# Altium schematic sheet IO.SchDoc
size A3; SheetNumber: 3; SheetTotal: 4
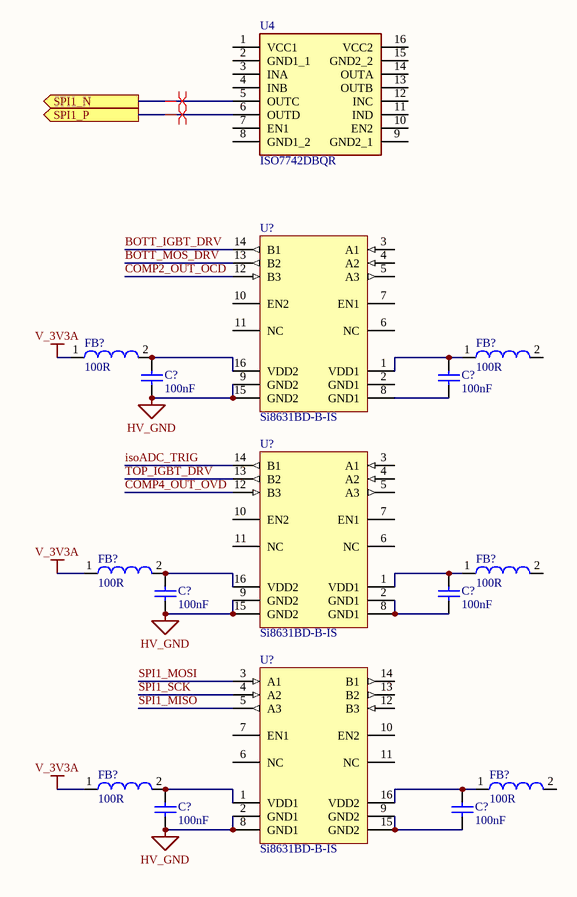
[diagram p0: IO.SchDoc]

## Parts
(Parts that share a designator on the sheet are numbered #1, #2 ... from top to bottom, then left to right.)
C?#1  100nF  [CAPC1608X90X35NL15T15]
C?#2  100nF  [CAPC1608X90X35NL15T15]
C?#3  100nF  [CAPC1608X90X35NL15T15]
C?#4  100nF  [CAPC1608X90X35NL15T15]
C?#5  100nF  [CAPC1608X90X35NL15T15]
C?#6  100nF  [CAPC1608X90X35NL15T15]
FB?#1  100R  [SMD-0603]
FB?#2  100R  [SMD-0603]
FB?#3  100R  [SMD-0603]
FB?#4  100R  [SMD-0603]
FB?#5  100R  [SMD-0603]
FB?#6  100R  [SMD-0603]
U4  ISO7742DBQR  [SOP64P600X175-16N]
U?#1  Si8631BD-B-IS  [SLAB-SOIC-16-WB_N]
U?#2  Si8631BD-B-IS  [SLAB-SOIC-16-WB_N]
U?#3  Si8631BD-B-IS  [SLAB-SOIC-16-WB_N]

## Ports
SPI1_N (out), SPI1_P (out)

## Nets
HV_GND: C?#1.1 C?#3.1 C?#5.1 U?#1.9(GND2) U?#1.15(GND2) U?#2.9(GND2) U?#2.15(GND2) U?#3.2(GND1) U?#3.8(GND1)
V_3V3A: FB?#1.1 FB?#3.1 FB?#5.1
BOTT_IGBT_DRV: U?#1.14(B1)
BOTT_MOS_DRV: U?#1.13(B2)
COMP2_OUT_OCD: U?#1.12(B3)
COMP4_OUT_OVD: U?#2.12(B3)
isoADC_TRIG: U?#2.14(B1)
SPI1_MISO: U?#3.5(A3)
SPI1_MOSI: U?#3.3(A1)
SPI1_N: U4.5(OUTC) ; port SPI1_N
SPI1_P: U4.6(OUTD) ; port SPI1_P
SPI1_SCK: U?#3.4(A2)
TOP_IGBT_DRV: U?#2.13(B2)
NetC?#1_2: C?#1.2 FB?#1.2 U?#1.16(VDD2)
NetC?#2_1: C?#2.1 U?#1.8(GND1)
NetC?#2_2: C?#2.2 FB?#2.1 U?#1.1(VDD1)
NetC?#3_2: C?#3.2 FB?#3.2 U?#2.16(VDD2)
NetC?#4_1: C?#4.1 U?#2.2(GND1) U?#2.8(GND1)
NetC?#4_2: C?#4.2 FB?#4.1 U?#2.1(VDD1)
NetC?#5_2: C?#5.2 FB?#5.2 U?#3.1(VDD1)
NetC?#6_1: C?#6.1 U?#3.9(GND2) U?#3.15(GND2)
NetC?#6_2: C?#6.2 FB?#6.1 U?#3.16(VDD2)

Not connected (* = marked no-connect by the designer): FB?#2 2; FB?#4 2; FB?#6 2; U4 1(VCC1) 2(GND1_1) 3(INA) 4(INB) 7(EN1) 8(GND1_2) 9(GND2_1) 10(EN2) 11(IND) 12(INC) 13(OUTB) 14(OUTA) 15(GND2_2) 16(VCC2); U?#1 2(GND1) 3(A1) 4(A2) 5(A3) 6(NC) 7(EN1) 10(EN2) 11(NC); U?#2 3(A1) 4(A2) 5(A3) 6(NC) 7(EN1) 10(EN2) 11(NC); U?#3 6(NC) 7(EN1) 10(EN2) 11(NC) 12(B3) 13(B2) 14(B1)

## Layout directives
differential pair: SPI1_N, SPI1_P

## Library data of the parts
C?#1-C?#6 = CMP-2006-04245-1: Manufacturer: AVX Interconnect / Elco; Part Number: 06035A151JAT2A.; Manufacturer Part Number: 06035A151JAT2A; Dielectric Material: Ceramic; Capacitance: 100pF; Tolerance: 5%; Voltage Rating (DC): 50V; Dielectric: C0G; Temperature Coefficient: 30ppm/°C; Insulation Resistance: 100GR; Supplier 1: Digi-Key; Supplier Part Number 1: 478-1177-1-ND; RoHS: Yes; Category: Ceramic Capacitors; Stock 1: 63714; Pricing 1: 1=0.12000, 10=0.08900, 100=0.04180, 500=0.02932, 1000=0.02428 (USD); Mount: Surface Mount,PCB; Case/Package: 0603; Number of Pins: 2; Case Code (Metric): 1608; Case Code (Imperial): 0603; Contact Plating: Tin,Matte; Min Operating Temperature: -55°C; Max Operating Temperature: 125°C; Voltage Rating: 50V; Packaging: Tape and Reel; Package Quantity: 1; Termination: SMD/SMT; Voltage: 50V; Length: 1.6mm; Height: 0.86mm; Width: 0.032inch; Depth: 0.81mm; Thickness: 0.035inch; Radiation Hardening: No; Lead Free: Lead Free; REACH SVHC: No SVHC; ComponentLink1URL: https://datasheet.ciiva.com/1124/84496-1124721.pdf?src-supplier=Element14; ComponentLink1Description: https://datasheet.ciiva.com/1124/84496-1124721.pdf?src-supplier=Element14; ComponentLink2URL: https://datasheet.ciiva.com/2987/ccog-2987781.pdf?src-supplier=Avnet; ComponentLink2Description: https://datasheet.ciiva.com/2987/ccog-2987781.pdf?src-supplier=Avnet; ComponentLink3URL: https://datasheet.ciiva.com/7855/759117-7855061.pdf?src-supplier=Element14; ComponentLink3Description: https://datasheet.ciiva.com/7855/759117-7855061.pdf?src-supplier=Element14; ComponentLink4URL: https://datasheet.ciiva.com/2987/ccog-2987782.pdf?src-supplier=Avnet; ComponentLink4Description: https://datasheet.ciiva.com/2987/ccog-2987782.pdf?src-supplier=Avnet; ComponentLink5URL: https://datasheet.ciiva.com/156/ccog-156216.pdf?src-supplier=Digi-Key; ComponentLink5Description: https://datasheet.ciiva.com/156/ccog-156216.pdf?src-supplier=Digi-Key; ComponentLink6URL: https://datasheet.ciiva.com/156/ccog-156217.pdf?src-supplier=Digi-Key; ComponentLink6Description: https://datasheet.ciiva.com/156/ccog-156217.pdf?src-supplier=Digi-Key; ComponentLink7URL: https://datasheet.ciiva.com/156/ccog-156218.pdf?src-supplier=Digi-Key; ComponentLink7Description: https://datasheet.ciiva.com/156/ccog-156218.pdf?src-supplier=Digi-Key; ComponentLink8URL: https://datasheet.ciiva.com/16300/ccog-16300429.pdf?src-supplier=Future+Electronics; ComponentLink8Description: https://datasheet.ciiva.com/16300/ccog-16300429.pdf?src-supplier=Future+Electronics; ComponentLink9URL: https://datasheet.ciiva.com/22699/84496-22699966.pdf?src-supplier=Element14; ComponentLink9Description: https://datasheet.ciiva.com/22699/84496-22699966.pdf?src-supplier=Element14; ComponentLink10URL: https://datasheet.ciiva.com/5418/ccog-5418335.pdf?src-supplier=Mouser; ComponentLink10Description: https://datasheet.ciiva.com/5418/ccog-5418335.pdf?src-supplier=Mouser; ComponentLink11URL: https://datasheet.ciiva.com/16538/ccog-16538111.pdf?src-supplier=Avnet+Asia; ComponentLink11Description: https://datasheet.ciiva.com/16538/ccog-16538111.pdf?src-supplier=Avnet+Asia
FB?#1-FB?#6 = CMP-0220-00115-1: SMD EMI Suppression Ferrite Bead WE-CBF, Z = 1500 Ohm; DatasheetVersion: Dec-2005; ComponentLink1URL: http://www.we-online.com; PackageVersion: 2009; PackageDescription: Chip Inductor, 2-Leads, Body 1.6 x 0.8 mm; ComponentLink2URL: http://www.we-online.de/katalog/media/pdf/742792691.pdf; ComponentLink1Description: Manufacturer Link; ComponentLink2Description: Datasheet; Impedance: 1500 Ohm; PackageReference: SMD-0603
U4 = ISO7742DBQR: Integrated Circuit; Manufacturer_Name: Texas Instruments; Datasheet Link: http://www.ti.com/lit/gpn/iso7742; Height: 1.75mm; Manufacturer_Part_Number: ISO7742DBQR; Mouser Part Number: 595-ISO7742DBQR; Mouser Price/Stock: https://www.mouser.co.uk/ProductDetail/Texas-Instruments/ISO7742DBQR?qs=5aG0NVq1C4zKCRb0yvWOIw%3D%3D; Arrow Part Number: ISO7742DBQR; Arrow Price/Stock: https://www.arrow.com/en/products/iso7742dbqr/texas-instruments
U?#1-U?#3 = CMP-0512-00313-1: Low-Power Triple-Channel Digital Isolator, 150 Mbps, 5 kVRMS Isolation Rating, -40 to 125 degC, 16-pin SOIC; Manufacturer: Silicon Labs; Isolation Rating (kV): 5; Maximum Data Rate (Mbps): 150; AEC-Q100: TRUE; Sub-Family: Isolators; Maximum Propagation Delay (ns): 13; 10kV surge: FALSE; Channel Type: Unidirectional; Description: DGTL ISO 5KV 3CH GEN PURP 16SOIC; Number of Channels: 3; Propagation Delay: 13ns; Isolated Power: No; Pulse Width Distortion (PWD): 4.5ns; Min Supply Voltage: 2.5V; Max Supply Voltage: 5.5V; Rise Time: 4ns; Max Input Current: 13.4mA; Turn-On Delay Time: 10ns; Isolation Voltage: 5kV; Nominal Supply Current: 7.3mA; Power Dissipation: 275mW; Mounting Technology: Surface Mount; ComponentLink3Description: Package Specification; Code_JEDEC: MS-013; ComponentLink2Description: Datasheet; PartNumber: Si8631BD-B-IS; DatasheetVersion: Rev. 1.3; ComponentLink1URL: http://www.silabs.com/; PackageDescription: 16-Pin Wide Body Plastic Small Outline, Body 10.3 x 7.5 mm, Pitch 1.27 mm; PackageReference: SOIC-16-WB; ComponentLink2URL: http://www.silabs.com/Support%20Documents/TechnicalDocs/Si863x.pdf; ComponentLink1Description: Manufacturer URL; Enable Control: TRUE; ComponentLink3URL: https://www.silabs.com/Support%20Documents/TechnicalDocs/Si823x.pdf; Supplier 1: Newark; Supplier Part Number 1: 54X5690; Manufacturer Part Number: SI8631BD-B-IS; RoHS: Yes; Category: Power Management ICs; Pricing 1: 1=1.84000, 10=1.71000, 25=1.60000, 50=1.58000, 100=1.53000, 250=1.52000 (USD); Case/Package: SOIC; Number of Pins: 16; Weight: 0.001764oz; Min Operating Temperature: -40°C; Max Operating Temperature: 125°C; Packaging: Rail/Tube; Data Rate: 150Mbps; Type: General Purpose; Package Quantity: 46; Series: Automotive, AEC-Q100; Supply Current: 7.3mA; Length: 10.3mm; Width: 7.5mm; Depth: 2.65mm; RoHS Compliant: Yes; REACH SVHC: Unknown; ComponentLink4URL: https://datasheet.ciiva.com/2082/supportdocuments2ftechnicaldocs2fsi863x-2082936.pdf?src-supplier=Digi-Key; ComponentLink4Description: https://datasheet.ciiva.com/2082/supportdocuments2ftechnicaldocs2fsi863x-2082936.pdf?src-supplier=Digi-Key; ComponentLink5URL: https://datasheet.ciiva.com/46409/1816590-46409961.pdf?src-supplier=Element14; ComponentLink5Description: https://datasheet.ciiva.com/46409/1816590-46409961.pdf?src-supplier=Element14